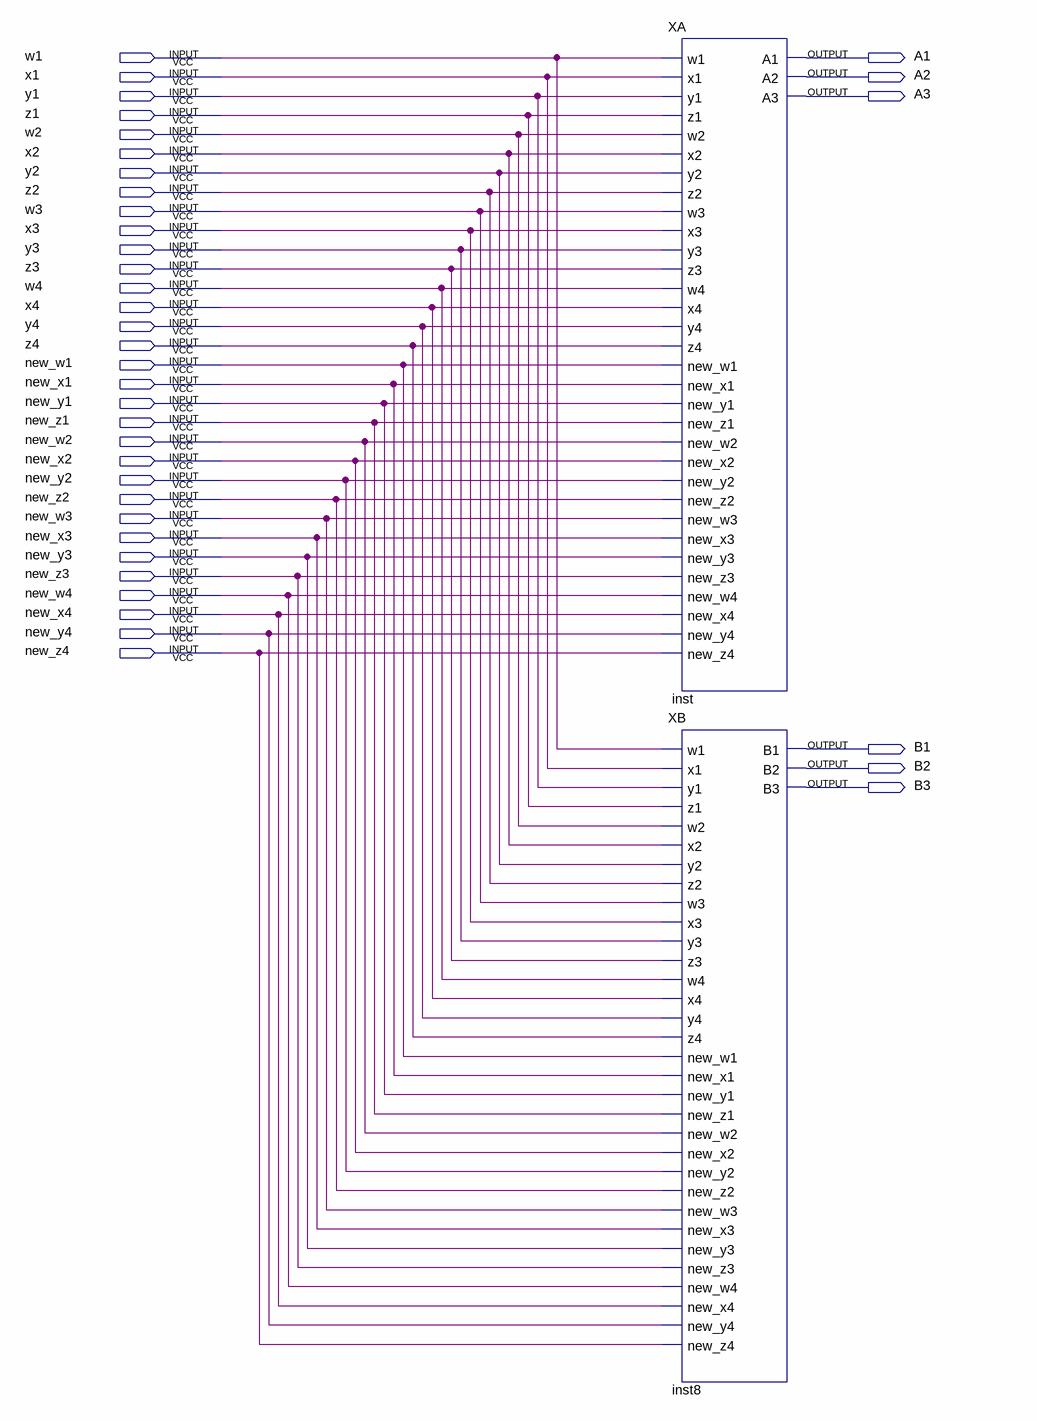
[diagram p0: schematic sheet]
// Quartus schematic XAXB.bdf as structural Verilog: 2 symbols, 38 pins
module XAXB (
  input  w1,
  input  x1,
  input  y1,
  input  z1,
  input  w2,
  input  x2,
  input  y2,
  input  z2,
  input  w3,
  input  x3,
  input  y3,
  input  z3,
  input  w4,
  input  x4,
  input  y4,
  input  z4,
  input  new_w1,
  input  new_x1,
  input  new_y1,
  input  new_z1,
  input  new_w2,
  input  new_x2,
  input  new_y2,
  input  new_z2,
  input  new_w3,
  input  new_x3,
  input  new_y3,
  input  new_z3,
  input  new_w4,
  input  new_x4,
  input  new_y4,
  input  new_z4,
  output A1,
  output A2,
  output A3,
  output B1,
  output B2,
  output B3
);

  XA inst (
    .w1(w1), .x1(x1), .y1(y1), .z1(z1), .w2(w2), .x2(x2), .y2(y2), .z2(z2), .w3(w3), .x3(x3), .y3(y3),
    .z3(z3), .w4(w4), .x4(x4), .y4(y4), .z4(z4), .new_w1(new_w1), .new_x1(new_x1), .new_y1(new_y1),
    .new_z1(new_z1), .new_w2(new_w2), .new_x2(new_x2), .new_y2(new_y2), .new_z2(new_z2), .new_w3(new_w3),
    .new_x3(new_x3), .new_y3(new_y3), .new_z3(new_z3), .new_w4(new_w4), .new_x4(new_x4), .new_y4(new_y4),
    .new_z4(new_z4), .A1(A1), .A2(A2), .A3(A3));
  XB inst8 (
    .w1(w1), .x1(x1), .y1(y1), .z1(z1), .w2(w2), .x2(x2), .y2(y2), .z2(z2), .w3(w3), .x3(x3), .y3(y3),
    .z3(z3), .w4(w4), .x4(x4), .y4(y4), .z4(z4), .new_w1(new_w1), .new_x1(new_x1), .new_y1(new_y1),
    .new_z1(new_z1), .new_w2(new_w2), .new_x2(new_x2), .new_y2(new_y2), .new_z2(new_z2), .new_w3(new_w3),
    .new_x3(new_x3), .new_y3(new_y3), .new_z3(new_z3), .new_w4(new_w4), .new_x4(new_x4), .new_y4(new_y4),
    .new_z4(new_z4), .B1(B1), .B2(B2), .B3(B3));
endmodule
